# EasyEDA schematic easyeda.json
TITLE: Trafficlight 1 SHR; REV: 1.0; Date: 2019-09-30; Sheet: 1/1; Drawn By: Simen Stensås; Company: NTNU
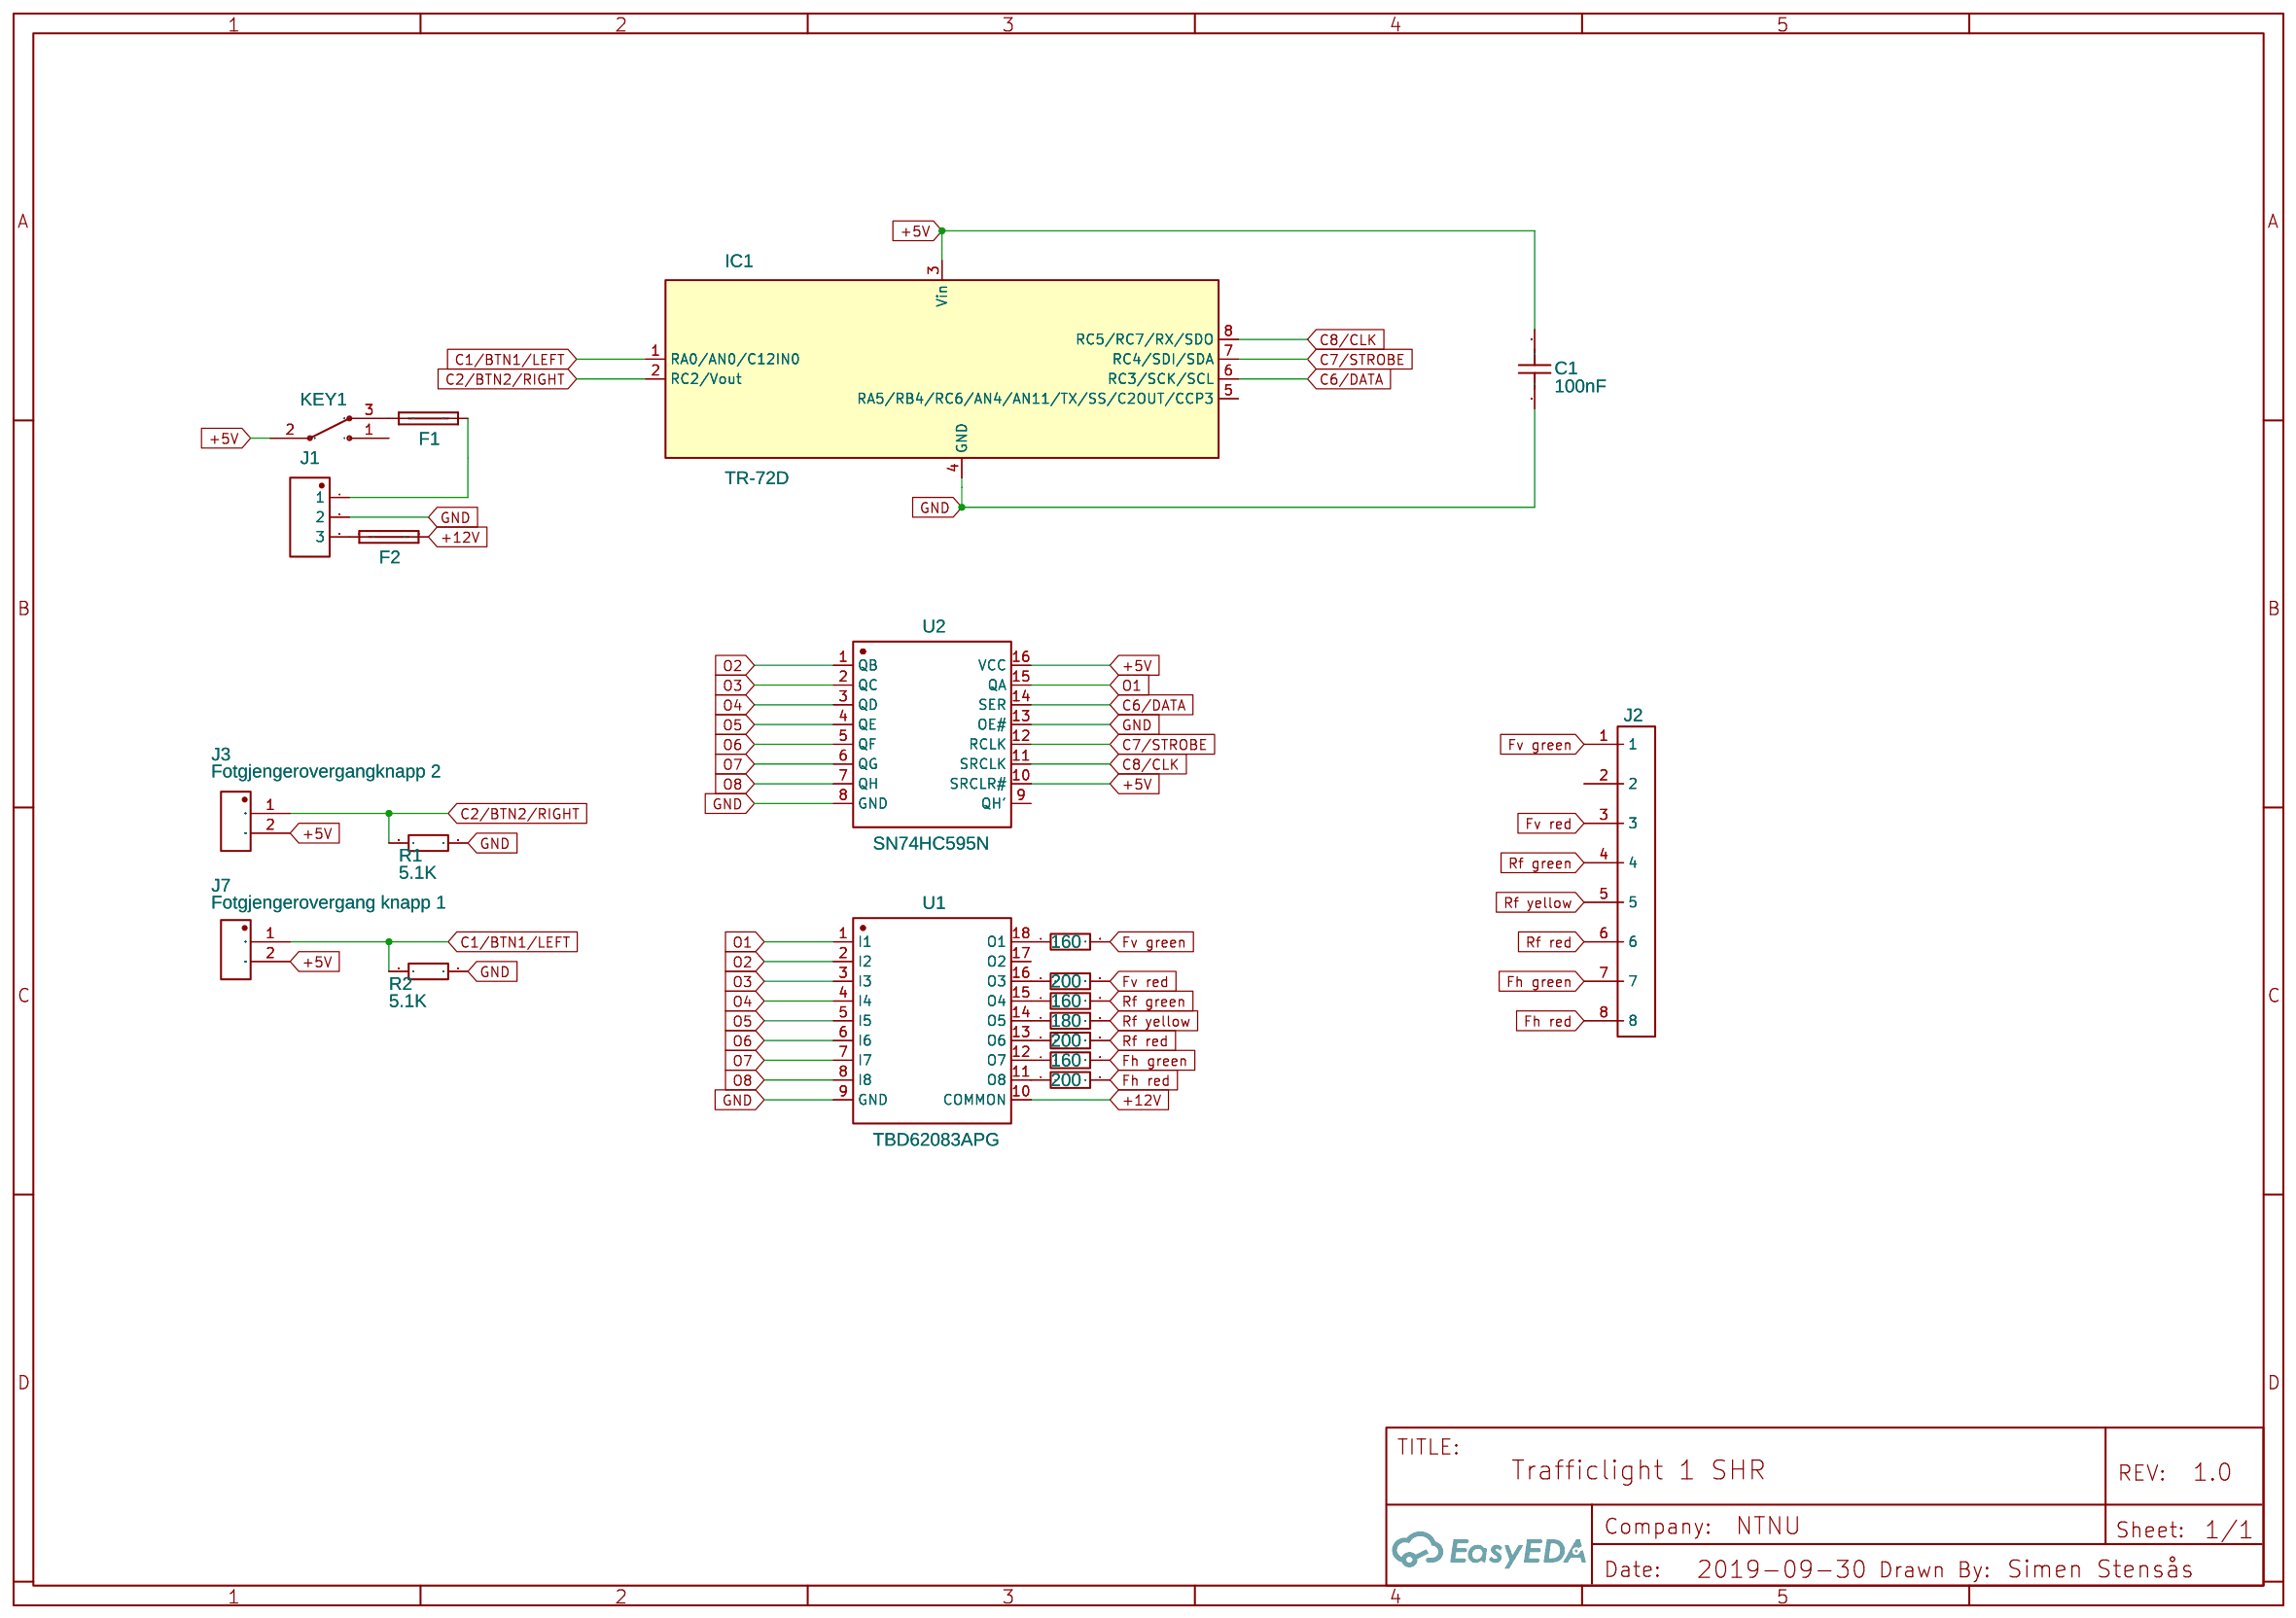
[diagram p0: schematic sheet]

## Parts
C1  100nF  [1210]
F1  NO  [OMF_125]
F2  NO  [OMF_125]
IC1  TR-72D  [IQRF_KON-SIM-01]
J1  KF127_3P_5.08  [KF127_3P_5.08]
J2  KF127-8P  [KF127-8P]
J3  Fotgjengerovergangknapp 2  [KF127_2P_5.08]
J7  Fotgjengerovergang knapp 1  [KF127_2P_5.08]
KEY1  MSK-11027 Toggle Switches  [MSK-11027]
R1  5.1K  [1206]
R2  5.1K  [1206]
R8  160  [1206]
R9  160  [1206]
R10  160  [1206]
R12  180  [1206]
R13  200  [1206]
R14  200  [1206]
R15  200  [1206]
U1  TBD62083APG  [DIP-18]
U2  SN74HC595N  [DIP-16_L19.8-W6.5-P2.54-LS7.6-BL]

## Library data of the parts
C1 = 1210B106K100CT: Supplier: LCSC; Supplier Part: C304011; Manufacturer: Huaxin S&T; Contributor: LCSC
F1 F2 = -: Manufacturer Part: 3403.0015.11; Supplier: Mouser; Supplier Part: 693-3403.0015.11; link: https://www.mouser.co.uk/ProductDetail/Schurter/3403001511?qs=sGAEpiMZZMtxU2g%2f1juGqdRmCQF0%252bT4VUkZkHB0fJk4%3d; Contributor: romiksm
IC1 = -: Contributor: Simen Stensas; license: https://www.gnu.org/licenses/lgpl-2.1.html
J1 = -: Manufacturer: Kefa Electronics; Contributor: GrahamG
J2 = -: Manufacturer: CIXI KAIFEN ELECTRONICS CO,. LTDA.; Contributor: milton.sanchez.alban
J3 J7 = -: Manufacturer: Kefa Electronics; Manufacturer Part: KF127L-5.08; Contributor: GrahamG
KEY1 = -: Supplier Part: C21381; Supplier: LCSC; Manufacturer: ReliaPro; image: http://image.lceda.cn/szlcsc/C21381.jpg
R1 R2 = RMC12065.1K1%N: Supplier: LCSC; Supplier Part: C325932; Manufacturer: Tyohm; Contributor: LCSC
R8-R10 = RC1206JR-07160RL: Supplier: LCSC; Manufacturer: YAGEO; Supplier Part: C137196
R12 = CR1206-FX-1800ELF: Supplier: LCSC; Supplier Part: C204708; Manufacturer: BOURNS; Contributor: LCSC
R13-R15 = QR1206J200RP05: Supplier: LCSC; Manufacturer: EVER OHMS; Contributor: LCSC; Supplier Part: C149886
U1 = -: Supplier: LCSC; Manufacturer: TOSHIBA; Contributor: LCSC; Supplier Part: C114143
U2 = -: Supplier: LCSC; Manufacturer: TI; image: //image.lceda.cn/szlcsc/C78711.jpg; Supplier Part: C78711

## Nets
+5V: C1.2 IC1.3(Vin) J3.2(PIN2) J7.2(PIN2) KEY1.2 U2.10(SRCLR#) U2.16(VCC)
+12V: F2.2 U1.10(COMMON)
GND: C1.1 IC1.4(GND) J1.2 R1.2 R2.2 U1.9(GND) U2.8(GND) U2.13(OE#)
C1/BTN1/LEFT: IC1.1(RA0/AN0/C12IN0) J7.1(PIN1) R2.1
C2/BTN2/RIGHT: IC1.2(RC2/Vout) J3.1(PIN1) R1.1
C6/DATA: IC1.6(RC3/SCK/SCL) U2.14(SER)
C7/STROBE: IC1.7(RC4/SDI/SDA) U2.12(RCLK)
C8/CLK: IC1.8(RC5/RC7/RX/SDO) U2.11(SRCLK)
Fh green: J2.7 R10.2
Fh red: J2.8 R15.2
Fv green: J2.1 R8.2
Fv red: J2.3 R13.2
O1: U1.1(I1) U2.15(QA)
O2: U1.2(I2) U2.1(QB)
O3: U1.3(I3) U2.2(QC)
O4: U1.4(I4) U2.3(QD)
O5: U1.5(I5) U2.4(QE)
O6: U1.6(I6) U2.5(QF)
O7: U1.7(I7) U2.6(QG)
O8: U1.8(I8) U2.7(QH)
Rf green: J2.4 R9.2
Rf red: J2.6 R14.2
Rf yellow: J2.5 R12.2
Net-(F1-1): F1.1 KEY1.3
Net-(F1-2): F1.2 J1.1
Net-(F2-1): F2.1 J1.3
Net-(R8-1): R8.1 U1.18(O1)
Net-(R9-1): R9.1 U1.15(O4)
Net-(R10-1): R10.1 U1.12(O7)
Net-(R12-1): R12.1 U1.14(O5)
Net-(R13-1): R13.1 U1.16(O3)
Net-(R14-1): R14.1 U1.13(O6)
Net-(R15-1): R15.1 U1.11(O8)

Not connected (* = marked no-connect by the designer): IC1 5(RA5/RB4/RC6/AN4/AN11/TX/SS/C2OUT/CCP3); J2 2; KEY1 1; U1 17(O2); U2 9(QH')
